# Altium schematic sheet embedded.SchDoc
size OrCAD B
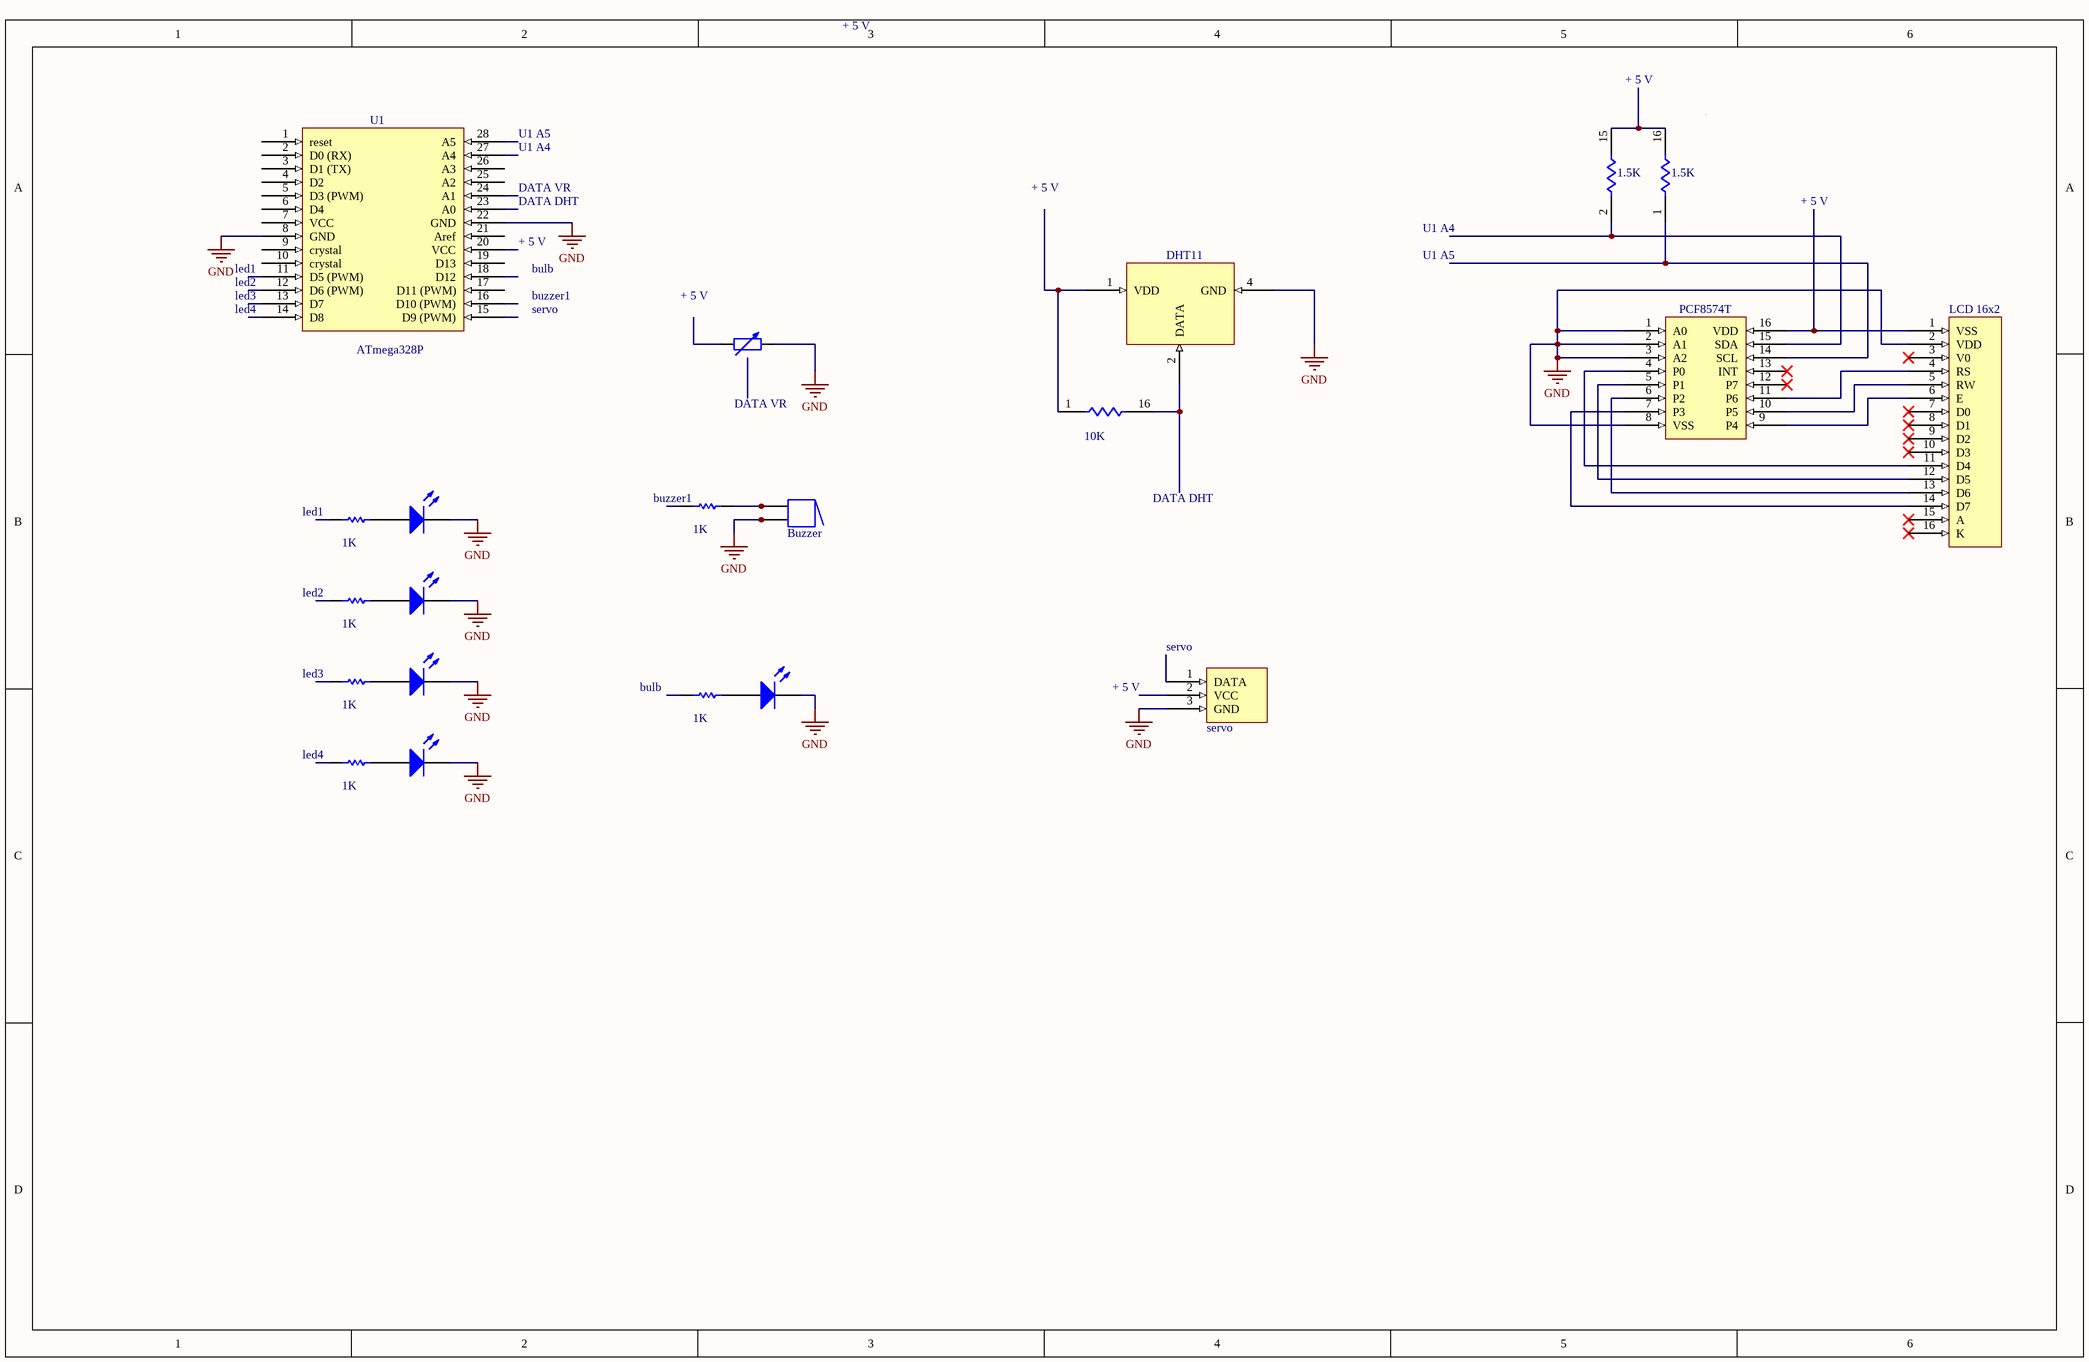
[diagram p0: embedded.SchDoc]

## Parts
(Parts that share a designator on the sheet are numbered #1, #2 ... from top to bottom, then left to right.)
*#1  Component_1  (value not drawn)
*#2  DHT11
*#3  PCF8574T  (value not drawn)
*#4  LCD 16x2  (value not drawn)
*#5  servo
D?#1  LED0  [LED-0]  (value not drawn)
D?#2  LED0  [LED-0]  (value not drawn)
D?#3  LED0  [LED-0]  (value not drawn)
D?#4  LED0  [LED-0]  (value not drawn)
D?#5  LED0  [LED-0]  (value not drawn)
LS?  Buzzer  [ABSM-1574]
R1  1.5K  [SOIC16_N]  (part B of 8)
R?#1  1.5K  [SOIC16_N]  (part A of 8)
R?#2  Res Adj2  [AXIAL-0.6]  (value not drawn)
R?#3  value 10K  [SOIC16_N]  (hidden comment: Res Pack1)  (part A of 8)
R?#4  value 1K  [AXIAL-0.3]  (hidden comment: Res1)
R?#5  value 1K  [AXIAL-0.3]  (hidden comment: Res1)
R?#6  value 1K  [AXIAL-0.3]  (hidden comment: Res1)
R?#7  value 1K  [AXIAL-0.3]  (hidden comment: Res1)
R?#8  value 1K  [AXIAL-0.3]  (hidden comment: Res1)
R?#9  value 1K  [AXIAL-0.3]  (hidden comment: Res1)

## Nets
GND: *#1.8(GND) *#1.22(GND) *#2.4(GND) *#3.1(A0) *#3.2(A1) *#3.3(A2) *#3.8(VSS) *#4.2(VDD) *#5.3(GND) D?#1.2(K) D?#2.2(K) D?#3.2(K) D?#4.2(K) D?#5.2(K) LS?.2 LS?.2A R?#2.2
Net*#2_1: *#2.1(VDD) R?#3.1
Net*#2_2: *#2.2(DATA) R?#3.16
Net*#3_4: *#3.4(P0) *#4.11(D4)
Net*#3_5: *#3.5(P1) *#4.12(D5)
Net*#3_6: *#3.6(P2) *#4.13(D6)
Net*#3_7: *#3.7(P3) *#4.14(D7)
Net*#3_9: *#3.9(P4) *#4.6(E)
Net*#3_10: *#3.10(P5) *#4.5(RW)
Net*#3_11: *#3.11(P6) *#4.4(RS)
Net*#3_14: *#3.14(SCL) R?#1.1
Net*#3_15: *#3.15(SDA) R1.2
Net*#3_16: *#3.16(VDD) *#4.1(VSS)
NetD?#1_1: D?#1.1(A) R?#5.2
NetD?#2_1: D?#2.1(A) R?#6.2
NetD?#3_1: D?#3.1(A) R?#7.2
NetD?#4_1: D?#4.1(A) R?#8.2
NetD?#5_1: D?#5.1(A) R?#9.2
NetLS?_1: LS?.1 LS?.1A R?#4.2
NetR1_15: R1.15 R?#1.16

Not connected (* = marked no-connect by the designer): *#1 1(reset) 2(D0_(RX)) 3(D1_(TX)) 4(D2) 5(D3_(PWM)) 6(D4) 7(VCC) 9(crystal) 10(crystal) 11(D5_(PWM)) 12(D6_(PWM)) 13(D7) 14(D8) 15(D9_(PWM)) 16(D10_(PWM)) 17(D11_(PWM)) 18(D12) 19(D13) 20(VCC) 21(Aref) 23(A0) 24(A1) 25(A2) 26(A3) 27(A4) 28(A5); *#3 12(P7)* 13(INT)*; *#4 3(V0)* 7(D0)* 8(D1)* 9(D2)* 10(D3)* 15(A)* 16(K)*; *#5 1(DATA) 2(VCC); R?#2 1; R?#4 1; R?#5 1; R?#6 1; R?#7 1; R?#8 1; R?#9 1

## Notes on the sheet
- + 5 V
- U1 A5
- U1 A4
- DATA DHT
- DATA VR
- (near *#1) led1
- (near *#1) led2
- (near *#1) led3
- buzzer1
- bulb
- (near R?#2) + 5 V
- (near *#1) led4
- servo
- (near R?#4) buzzer1
- (near R?#5) led1
- (near R?#6) led2
- (near R?#7) led3
- (near R?#8) bulb
- (near *#5) servo
- (near R?#9) led4
- (in symbol Component_1) U1; ATmega328P

## Library data of the parts
D?#1-D?#5 = LED0: Typical INFRARED GaAs LED; Published: 8-Jun-2000; LatestRevisionDate: 08-Jul-2005; LatestRevisionNote: Mech Layer 1 removed.; PackageReference: LED-0; Publisher: Altium Limited; PackageDescription: LED; 2 Leads
LS? = Buzzer: Magnetic Transducer Buzzer; Published: 24-Mar-1999; LatestRevisionDate: 17-Dec-2003; LatestRevisionNote: Schematic revised, PCB Footprint replaced.; DatasheetVersion: 17-Dec-2003; PackageReference: ABSM-1574; Publisher: Altium Limited; PackageDescription: Magnetic Transducer Buzzer; ComponentLink1Description: Manufacturer Link; ComponentLink1URL: http://www.megastar.com/linecard/buzzmode/index.php
R1 R?#1 = Res Pack1: Isolated Resistor Network - Parts; Sim Note: Enter the Resistance value into parameter field.; Value: 1K; Published: 24-Mar-1999; LatestRevisionDate: 29-May-2009; LatestRevisionNote: IPC-7351 Footprint Added.; PackageReference: SOIC16; Publisher: Altium Limited; PackageDescription: 16-Pin Small Outline Integrated Circuit 1.27 mm Pitch; Code_JEDEC: MS-012-AC; Code_IPC: SOIC127P600-16
R?#2 = Res Adj2: Variable Resistor; Value: 1K; Set Position: 0.5; Published: 8-Jun-2000; LatestRevisionDate: 17-Jul-2002; LatestRevisionNote: Re-released for DXP Platform.; PackageReference: AXIAL-0.6; Publisher: Altium Limited; PackageDescription: Axial Device, Thru-Hole; 2 Leads; 0.6 in Pin Spacing
R?#3 = Res Pack1: Isolated Resistor Network - Parts; Sim Note: Enter the Resistance value into parameter field.; Published: 24-Mar-1999; LatestRevisionDate: 29-May-2009; LatestRevisionNote: IPC-7351 Footprint Added.; PackageReference: SOIC16; Publisher: Altium Limited; PackageDescription: 16-Pin Small Outline Integrated Circuit 1.27 mm Pitch; Code_JEDEC: MS-012-AC; Code_IPC: SOIC127P600-16
R?#4-R?#9 = Res1: Resistor; Published: 8-Jun-2000; LatestRevisionDate: 17-Jul-2002; LatestRevisionNote: Re-released for DXP Platform.; PackageReference: AXIAL-0.3; Publisher: Altium Limited; PackageDescription: Axial Device, Thru-Hole; 2 Leads; 0.3 in Pin Spacing